# EAGLE schematic Advantech-Wise-1530-v1.0.0 (EAGLE 7.7.0)
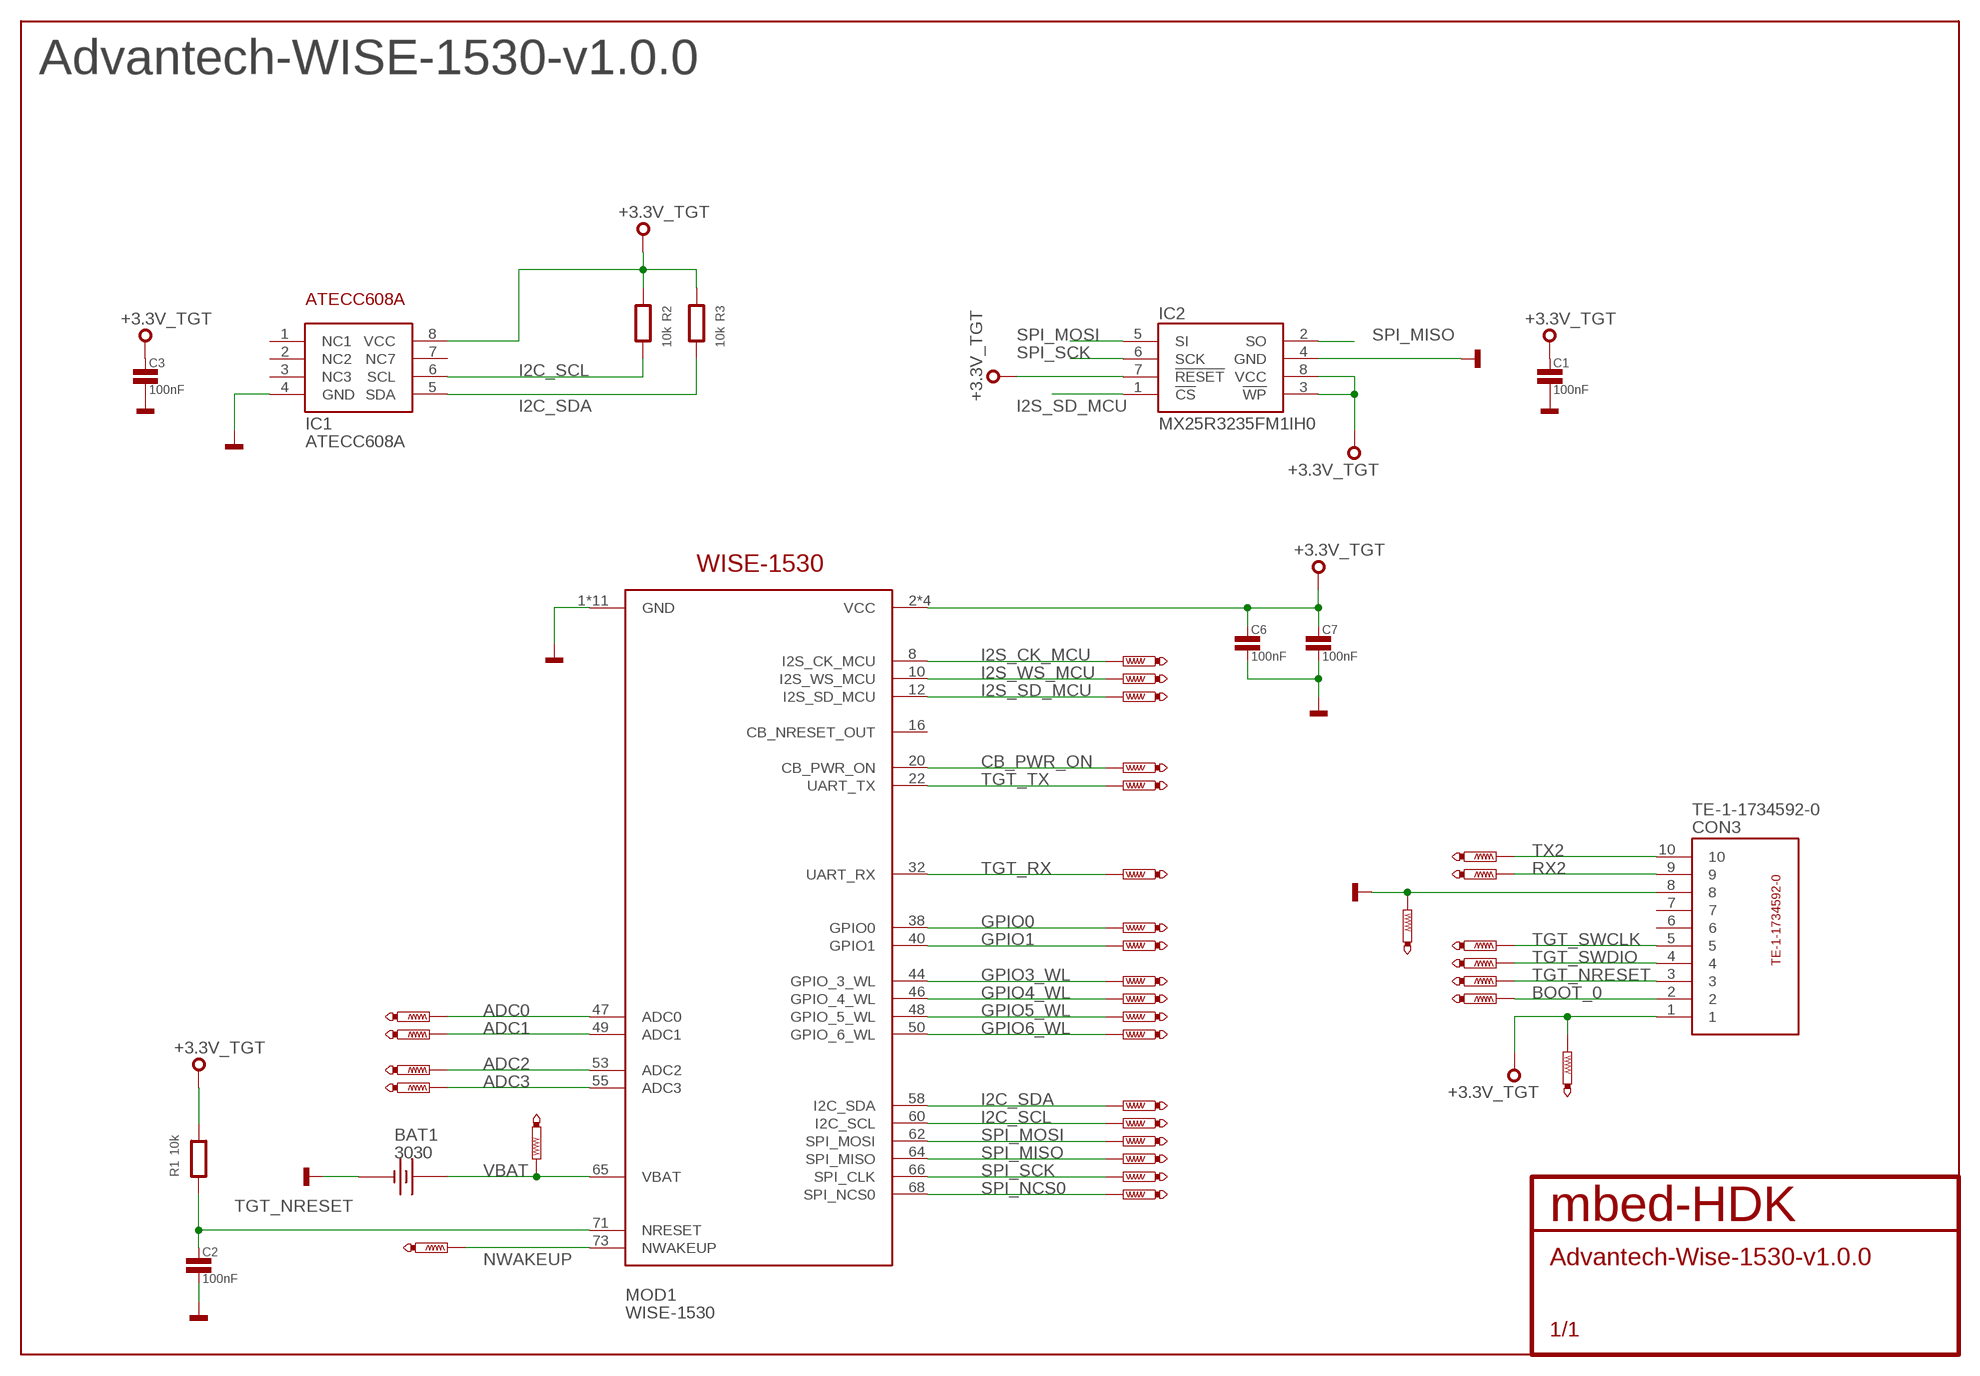
[diagram p0: schematic, sheet 1]

## Parts
BAT1  3030  [3030]
C1  100nF  C0603  [0603]
C2  100nF  C0603  [0603]
C3  100nF  C0603  [0603]
C6  100nF  C0603  [0603]
C7  100nF  C0603  [0603]
CON3  TE-1-1734592-0  [TE-1-1734592-0]
IC1  ATECC608A  [SO8]
IC2  MX25R3235FM1IH0  [SO8]
MOD1  WISE-1530  [MDT420E02001]
R1  10k  R0603  [0603]
R2  10k  R0603  [0603]
R3  10k  R0603  [0603]
TP3  PTR1TP08R  [TP08R]
TP4  PTR1TP08R  [TP08R]
TP5  PTR1TP08R  [TP08R]
TP6  PTR1TP08R  [TP08R]
TP7  PTR1TP08R  [TP08R]
TP8  PTR1TP08R  [TP08R]
TP9  PTR1TP08R  [TP08R]
TP10  PTR1TP08R  [TP08R]
TP11  PTR1TP08R  [TP08R]
TP12  PTR1TP08R  [TP08R]
TP13  PTR1TP08R  [TP08R]
TP14  PTR1TP08R  [TP08R]
TP15  PTR1TP08R  [TP08R]
TP16  PTR1TP08R  [TP08R]
TP17  PTR1TP08R  [TP08R]
TP18  PTR1TP08R  [TP08R]
TP19  PTR1TP08R  [TP08R]
TP20  PTR1TP08R  [TP08R]
TP21  PTR1TP08R  [TP08R]
TP22  PTR1TP08R  [TP08R]
TP23  PTR1TP08R  [TP08R]
TP24  PTR1TP08R  [TP08R]
TP25  PTR1TP08R  [TP08R]
TP26  PTR1TP08R  [TP08R]
TP27  PTR1TP08R  [TP08R]
TP28  PTR1TP08R  [TP08R]
TP29  PTR1TP08R  [TP08R]
TP30  PTR1TP08R  [TP08R]
TP31  PTR1TP08R  [TP08R]
TP32  PTR1TP08R  [TP08R]
TP33  PTR1TP08R  [TP08R]
TP34  PTR1TP08R  [TP08R]

## Nets
+3.3V_TGT: C1.1 C3.1 C6.1 C7.1 CON3.1 IC1.8(VCC) IC2.3(!WP) IC2.7(!RESET) IC2.8(VCC) MOD1.2(VCC) MOD1.4(VCC) MOD1.72(VCC) MOD1.74(VCC) R1.2 R2.1 R3.1 TP12.TP
ADC0: MOD1.47(ADC0) TP29.TP
ADC1: MOD1.49(ADC1) TP30.TP
ADC2: MOD1.53(ADC2) TP31.TP
ADC3: MOD1.55(ADC3) TP32.TP
BOOT_0: CON3.2 TP8.TP
CB_PWR_ON: MOD1.20(CB_PWR_ON) TP14.TP
GND: BAT1.NEG(-) C1.2 C2.2 C3.2 C6.2 C7.2 CON3.8 IC1.4(GND) IC2.4(GND) MOD1.1(GND) MOD1.7(GND) MOD1.18(GND) MOD1.33(GND) MOD1.39(GND) MOD1.45(GND) MOD1.51(GND) MOD1.57(GND) MOD1.63(GND) MOD1.69(GND) MOD1.75(GND) TP13.TP
GPIO0: MOD1.38(GPIO0) TP27.TP
GPIO1: MOD1.40(GPIO1) TP26.TP
GPIO3_WL: MOD1.44(GPIO_3_WL) TP25.TP
GPIO4_WL: MOD1.46(GPIO_4_WL) TP24.TP
GPIO5_WL: MOD1.48(GPIO_5_WL) TP23.TP
GPIO6_WL: MOD1.50(GPIO_6_WL) TP22.TP
I2C_SCL: IC1.6(SCL) MOD1.60(I2C_SCL) R2.2 TP20.TP
I2C_SDA: IC1.5(SDA) MOD1.58(I2C_SDA) R3.2 TP21.TP
I2S_CK_MCU: MOD1.8(I2S_CK_MCU) TP9.TP
I2S_SD_MCU: IC2.1(!CS) MOD1.12(I2S_SD_MCU) TP11.TP
I2S_WS_MCU: MOD1.10(I2S_WS_MCU) TP10.TP
NWAKEUP: MOD1.73(NWAKEUP) TP34.TP
RX2: CON3.9 TP6.TP
SPI_MISO: IC2.2(SO) MOD1.64(SPI_MISO) TP18.TP
SPI_MOSI: IC2.5(SI) MOD1.62(SPI_MOSI) TP19.TP
SPI_NCS0: MOD1.68(SPI_NCS0) TP16.TP
SPI_SCK: IC2.6(SCK) MOD1.66(SPI_CLK) TP17.TP
TGT_NRESET: C2.1 CON3.3 MOD1.71(NRESET) R1.1 TP5.TP
TGT_RX: MOD1.32(UART_RX) TP28.TP
TGT_SWCLK: CON3.5 TP3.TP
TGT_SWDIO: CON3.4 TP4.TP
TGT_TX: MOD1.22(UART_TX) TP15.TP
TX2: CON3.10 TP7.TP
VBAT: BAT1.P$1(+) BAT1.P$2(+) MOD1.65(VBAT) TP33.TP
Unconnected: CON3.6 CON3.7 IC1.1(NC1) IC1.2(NC2) IC1.3(NC3) IC1.7(NC7) MOD1.16(CB_NRESET_OUT)

## Notes on the sheet
- Advantech-WISE-1530-v1.0.0

## Library data of the parts
BAT1 = mbed-HDK-Connector:3030: CR927, CR1025 Battery Holder for 9-10mm Cells-Tin Nickel Plated SMD; MF: Keystone; MFN: 3030; OC-DIGIKEY: 36-3030-ND; OC-MOUSER: 534-3030; OC-NEWARK: 39T8899
C1-C3 C6 C7 = mbed-HDK-RLC:C: Capacitor
CON3 = mbed-HDK-Connector:TE-1-1734592-0: 10 way FPC cable connector; MF: TE Connectivity; MFN: TE-1-1734592-0; OC-DIGIKEY: A100282CT-ND; OC-MOUSER: 571-1-1734592-0
IC1 = mbed-HDK-MF-ATMEL:ATECC608A: I2C Secure element and crytpo accelerator; MF: Atmel; MFN: ATECC608A; OC-DIGIKEY: ATECC608A-SSHDA-TCT-ND; OC-MOUSER: 556-ATECC608ASSHDAB
IC2 = mbed-HDK-IC:MX25R3235FM1IH0: Serial Flash 32 Mb 80 Mhz; MF: Macronix; MFN: MX25R3235FM1IH0; OC-DIGIKEY: 1092-1175-ND
MOD1 = mbed-HDK-Connector:WISE-1530: Connector for Advantex WISE-1530 module; MF: Amphenol; MFN: MDT420E02001; OC-DIGIKEY: na; OC-MOUSER: 523-MDT420E02001; OC-NEWARK: na
R1-R3 = mbed-HDK-RLC:R: Resistor
TP3-TP34 = mbed-HDK-Test:PTR1: TEST PIN